# Altium schematic sheet POWER.SchDoc
size A3
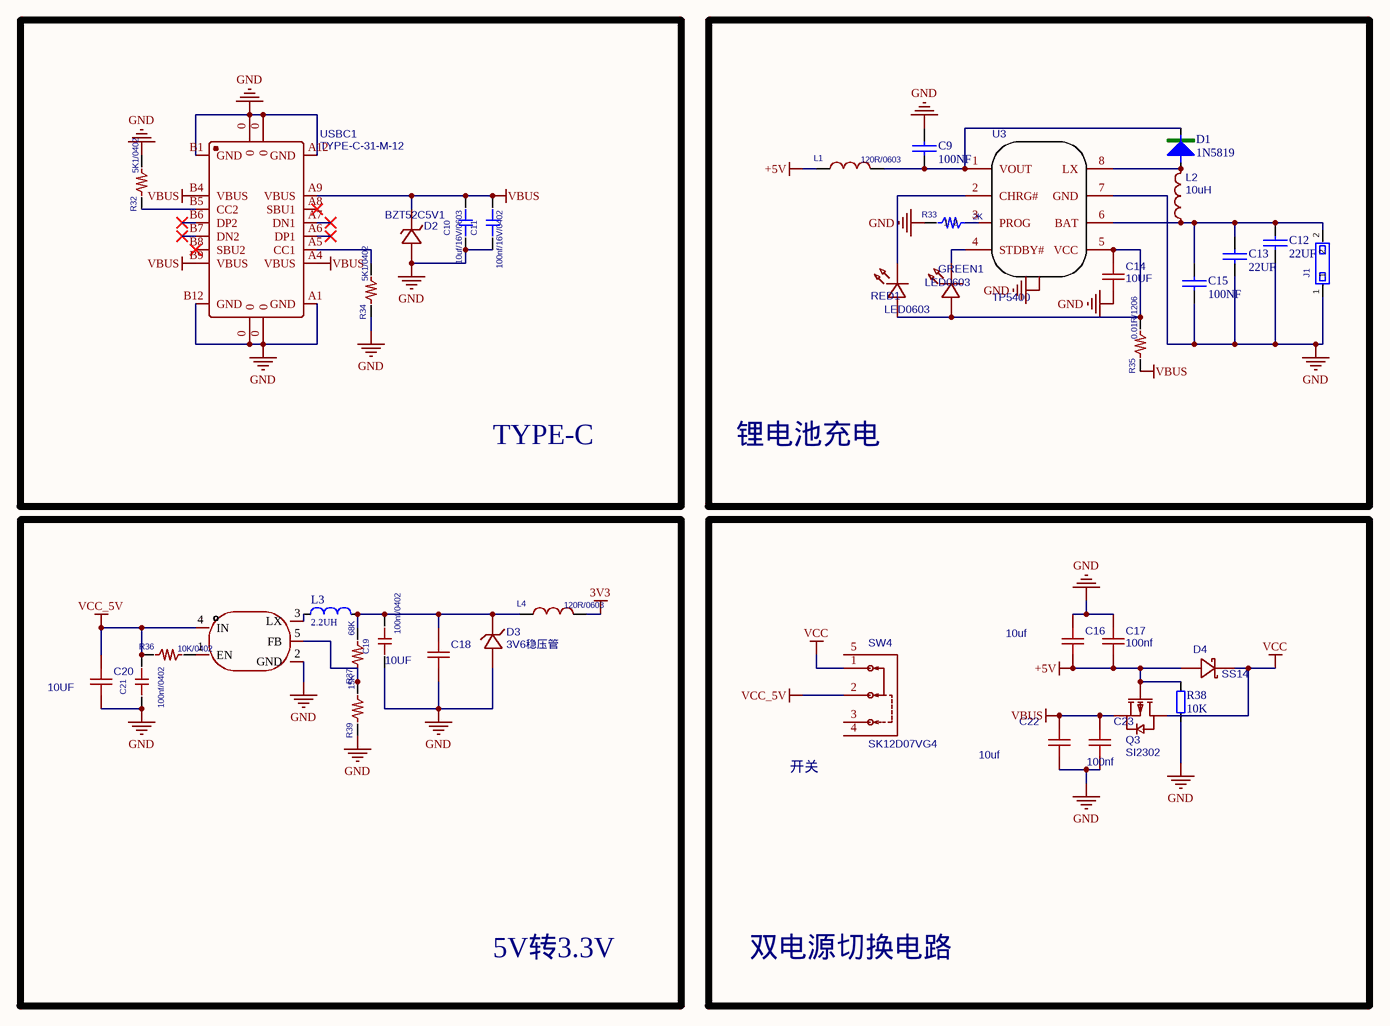
[diagram p0: POWER.SchDoc]

## Parts
C9  100NF  [C0402]
C10  value 10uf/16V/0603  [C0402]  (hidden comment: 100nf)
C11  value 100nf/16V/0402  [C0402]  (hidden comment: 100nf)
C12  22UF  [C0603]
C13  22UF  [C0603]
C14  10UF  [C0402]
C15  100NF  [C0402]
C16  10uf  [C0603]
C17  100nf  [C0402]
C18  10UF  [C0603]
C19  value 100nf/0402  [C0402]  (hidden comment: 100nf)
C20  10UF  [C0603]
C21  value 100nf/0402  [C0402]  (hidden comment: 100nf)
C22  10uf  [C0603]
C23  100nf  [C0402]
D1  1N5819  [SOD-123_L2.7-W1.6]
D2  BZT52C5V1  [SOD-123_L2.7-W1.6]
D3  3V6稳压管  [SOD-123_L2.7-W1.6]
D4  SS14  [SOD-123_L2.7-W1.6]
GREEN1  LED0603  [LED0603]
J1  1X2PIN_SMD  [SMD1X2_2.54]  (value not drawn)
L1  value 120R/0603  [L0603]  (hidden comment: 120R)
L2  10uH  [L_SMD_L4.0-W4.0]
L3  2.2UH  [L_SMD_L4.0-W4.0]
L4  value 120R/0603  [L0603]  (hidden comment: 120R)
Q3  SI2302  [SOT-23-3_L2.9-W1.6-P1.90]
R32  value 5K1/0402  [R0402]  (hidden comment: 5K1)
R33  2K  [R0603]
R34  value 5K1/0402  [R0402]  (hidden comment: 5K1)
R35  value 0.01R/1206  [R1206]  (hidden comment: 0.01R)
R36  value 10K/0402  [R0402]  (hidden comment: R0603)
R37  68K  [R0402]
R38  10K  [R0402]
R39  15K  [R0402]
RED1  LED0603  [LED0603]
SW4  SK12D07VG4  [SW-TH_5P]
U3  TP5400  [SOIC-8_L5.0-W4.0-P1.27-LS6.0_EP2.0]
U4  SY8088AAC  [SOT23-5]  (value not drawn)
USBC1  TYPE-C-31-M-12  [TYPEC_F_16_SMD_U]

## Blocks framed on the sheet
TYPE-C: C10 C11 D2 R32 R34 USBC1
锂电池充电: C9 C12-C15 D1 GREEN1 J1 L1 L2 R33 R35 RED1 U3
5V转3.3V: C18-C21 D3 L3 L4 R36 R37 R39 U4
双电源切换电路: C16 C17 C22 C23 D4 Q3 R38 SW4

## Nets
3V3: L4.2
+5V: C16.2 C17.2 D4.2 L1.1 Q3.1(G) R38.2
GND: C9.1 C10.1 C11.1 C12.2 C13.2 C14.1 C15.2 C16.1 C17.1 C18.1 C19.1 C20.1 C21.1 C22.1 C23.1 D2.2(A) D3.2 J1.1 R32.2 R33.1 R34.1 R38.1 R39.1 U3.7(GND) U3.9 U4.2(GND) USBC1.0 USBC1.A1(GND) USBC1.A12(GND) USBC1.B1(GND) USBC1.B12(GND)
VBUS: C10.2 C11.2 C22.2 C23.2 D2.1(K) Q3.2(S) R35.1 USBC1.A4(VBUS) USBC1.A9(VBUS) USBC1.B4(VBUS) USBC1.B9(VBUS)
VCC: D4.1 Q3.3(D) SW4.1
VCC_5V: C20.2 C21.2 R36.1 SW4.2 U4.4(IN)
NetC9_2: C9.2 D1.2 L1.2 U3.1(VOUT)
NetC12_1: C12.1 C13.1 C15.1 J1.2 L2.1 U3.6(BAT)
NetC14_2: C14.2 GREEN1.1 R35.2 RED1.1 U3.5(VCC)
NetC18_2: C18.2 C19.2 D3.1 L3.2 L4.1 R37.2
NetD1_1: D1.1 L2.2 U3.8(LX)
NetGREEN1_2: GREEN1.2 U3.4(STDBY#)
NetL3_1: L3.1 U4.3(LX)
NetR32_1: R32.1 USBC1.B5(CC2)
NetR33_2: R33.2 U3.3(PROG)
NetR34_2: R34.2 USBC1.A5(CC1)
NetR36_2: R36.2 U4.1(EN)
NetR37_1: R37.1 R39.2 U4.5(FB)
NetRED1_2: RED1.2 U3.2(CHRG#)

Not connected (* = marked no-connect by the designer): SW4 3 4 5; USBC1 A6(DP1)* A7(DN1)* A8(SBU1)* B6(DP2)* B7(DN2)* B8(SBU2)*

## Notes on the sheet
- 开关

## Library data of the parts
C9 C12 C13 C15 = C0805: Capacitor
C10 C11 C19 C21 = C0402: PCB DECAL: CAP_0603_FIRE
C14 C18 C20 = C0603: BOM_Manufacturer: Samsung Electro-Mechanics; nameAlias: Value; Contributor: LCSC; BOM_Supplier: LCSC; BOM_Supplier Part: C15415; BOM_Manufacturer Part: 10uF; spicePre: C; spiceSymbolName: 10UF
C16 C17 C22 C23 = 10uf: BOM_Manufacturer: Samsung Electro-Mechanics; nameAlias: Value; Contributor: LCSC; BOM_Supplier: LCSC; BOM_Supplier Part: C15415; BOM_Manufacturer Part: 10uF; spicePre: C; spiceSymbolName: 10UF
D1 = 1N5819: 肖特基二极管
D2 = BZT52C5V1_C1884555: BOM_Manufacturer: YFW佑风微; Contributor: LCSC; BOM_Supplier: LCSC; BOM_Supplier Part: C1884555; BOM_Manufacturer Part: BZT52C5V1; BOM_JLCPCB Part Class: Extended Part; spicePre: D; spiceSymbolName: BZT52C5V1_C1884555
D3 = D_STB: 稳压管; BOM_Manufacturer: SK; BOM_Manufacturer Part: BZT52C3V3; Contributor: LCSC; BOM_Supplier: LCSC; BOM_Supplier Part: C216707; BOM_JLCPCB Part Class: Extended Part; spicePre: D; spiceSymbolName: BZT52C3V3_C216707
D4 = SS34_C2909963: BOM_Manufacturer: YONGYUTAI(永裕泰); BOM_Manufacturer Part: SS34; Contributor: LCSC; BOM_Supplier: LCSC; BOM_Supplier Part: C2909963; BOM_JLCPCB Part Class: Extended Part; spicePre: D; spiceSymbolName: SS34_C2909963
GREEN1 RED1 = LED0603: BOM_Manufacturer: EVERLIGHT(台湾亿光); BOM_Manufacturer Part: 19-217/R6C-AL1M2VY/3T; Contributor: LCEDA_01; BOM_Supplier Part: C72044; BOM_Supplier: LCSC; spicePre: L; spiceSymbolName: LED-0603_R
L1 L4 = FB0603: 0603; Manufacturer #1 PN: BEAD; PCB DECAL: L0603
L2 = 10uH: BOM_Manufacturer: Sunlord; BOM_Manufacturer Part: SWPA4030S100MT; nameAlias: Inductance; BOM_Supplier: LCSC; BOM_Supplier Part: C38117; BOM_JLCPCB Part Class: Extended Part; spicePre: L; spiceSymbolName: SWPA4030S100MT
L3 = INDUCTOR: 电感
Q3 = FDN338P_C518789: P场效应管; BOM_Manufacturer: HUASHUO; Contributor: LCSC; BOM_Supplier: LCSC; BOM_Supplier Part: C518789; BOM_Manufacturer Part: FDN338P; BOM_JLCPCB Part Class: Extended Part; spicePre: Q; spiceSymbolName: FDN338P_C518789
R32 R34 R36 R37 R39 = R0402: PCB DECAL: R_0603
  R37: Value: 68K
  R39: Value: 15K
R33 = R0603: PCB DECAL: R_0603; Value: 2K
R35 = R1206: PCB DECAL: R_0603
R38 = R0402
SW4 = SW-bodong: 拨动开关; BOM_Manufacturer: SHOU HAN; Contributor: LCSC; BOM_Supplier: LCSC; BOM_Supplier Part: C393937; BOM_Manufacturer Part: SK12D07VG4; BOM_JLCPCB Part Class: Extended Part; spicePre: S; spiceSymbolName: SK12D07VG4
U3 = TP5400: 锂电池充放电; BOM_Manufacturer: TOPPOWER; BOM_Supplier: LCSC; BOM_Manufacturer Part: TP5400; BOM_Supplier Part: C24154; BOM_JLCPCB Part Class: Extended Part; spicePre: U; spiceSymbolName: TP5400
U4 = SY8088AAC: Manufacturer: 矽力杰silergy; Add into BOM: yes; Function: 降压型; Name: SY8088AAC; Symbol: SY8088AAC; Device: SY8088AAC; LCSC Part Name: 降压型; Supplier Part: C79313; Manufacturer Part: SY8088AAC; Supplier Footprint: SOT-23-5; JLCPCB Part Class: Extended Part; Datasheet: https://atta.szlcsc.com/upload/public/pdf/source/20170329/1490752163260.pdf; Supplier: LCSC; Convert to PCB: yes; Synchronous Rectification: -; Number of Outputs: -; Topology: -; Input Voltage: -; Output Current (Max): -; Switching Frequency: -
USBC1 = TYPE-C-31-M-12: BOM_Manufacturer: Rectangular Connectors - Contacts; Contributor: LCSC; BOM_Supplier: LCSC; BOM_Supplier Part: C165948; BOM_Manufacturer Part: TYPE-C-31-M-12; spicePre: U; spiceSymbolName: TYPE-C-31-M-12
J1 = 1X2PIN_SMD: PCB DECAL: 1X2PIN_SMD